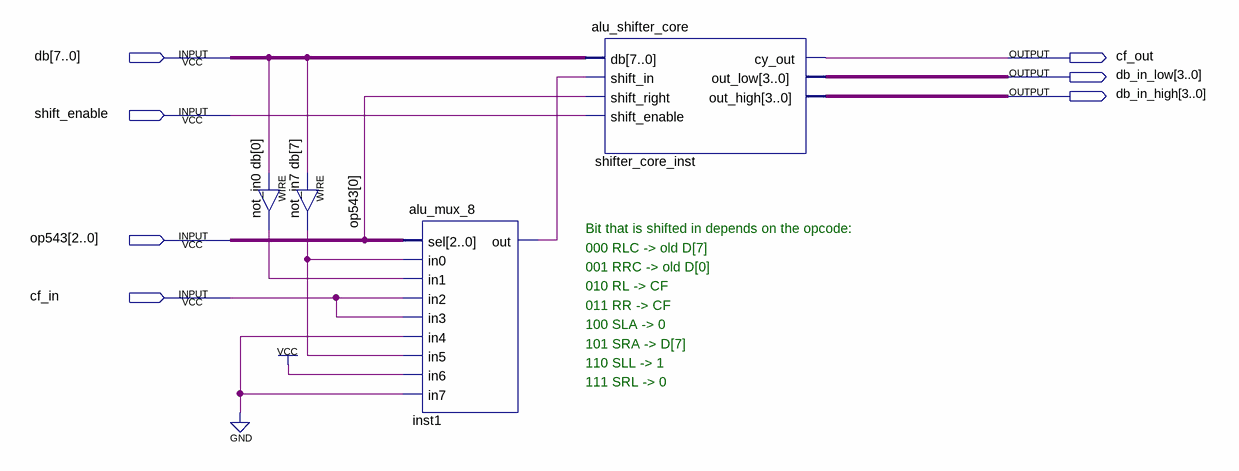
[diagram p0: schematic sheet]
// Quartus schematic alu_shifter.bdf as structural Verilog: 4 symbols, 7 pins
module alu_shifter (
  input  [7:0] db,
  input  shift_enable,
  input  [2:0] op543,
  input  cf_in,
  output cf_out,
  output [3:0] db_in_low,
  output [3:0] db_in_high
);

  wire inst1_out, not_in0_out, not_in7_out;

  assign not_in0_out = db[0];  // WIRE not_in0
  assign not_in7_out = db[7];  // WIRE not_in7
  alu_mux_8 inst1 (
    .sel(op543), .in0(not_in7_out), .in1(not_in0_out), .in2(cf_in), .in3(cf_in), .in4(1'b0),
    .in5(not_in7_out), .in6(1'b1), .in7(1'b0), .out(inst1_out));
  alu_shifter_core shifter_core_inst (
    .db(db), .shift_in(inst1_out), .shift_right(op543[0]), .shift_enable(shift_enable), .cy_out(cf_out),
    .out_low(db_in_low), .out_high(db_in_high));

  // Notes on the sheet:
  //   Bit that is shifted in depends on the opcode:
  //   000 RLC -> old D[7]
  //   001 RRC -> old D[0]
  //   010 RL -> CF
  //   011 RR -> CF
  //   100 SLA -> 0
  //   101 SRA -> D[7]
  //   110 SLL -> 1
  //   111 SRL -> 0
endmodule
